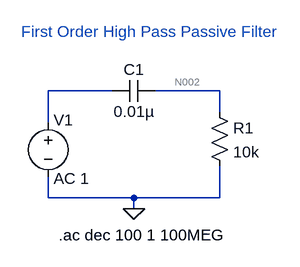
[diagram p0: schematic First Order High pass Passive Filter.asc]
First Order High pass Passive Filter.asc, the LTspice schematic file:
Version 4
SHEET 1 880 680
WIRE 176 96 80 96
WIRE 336 96 240 96
WIRE 336 128 336 96
WIRE 80 144 80 96
WIRE 80 256 80 224
WIRE 208 256 80 256
WIRE 336 256 336 208
WIRE 336 256 208 256
WIRE 208 272 208 256
FLAG 208 272 0
SYMBOL cap 176 112 R270
WINDOW 0 32 32 VTop 2
WINDOW 3 0 32 VBottom 2
SYMATTR InstName C1
SYMATTR Value 0.01µ
SYMBOL res 320 112 R0
SYMATTR InstName R1
SYMATTR Value 10k
SYMBOL voltage 80 128 R0
WINDOW 0 8 12 Left 2
WINDOW 123 8 99 Left 2
WINDOW 39 0 0 Left 0
SYMATTR InstName V1
SYMATTR Value ""
SYMATTR Value2 AC 1
TEXT 40 8 Left 2 ;First Order High Pass Passive Filter
TEXT 96 312 Left 2 !.ac dec 100 1 100MEG

The netlist it stands for:
* First Order High pass Passive Filter.asc
C1 N001 N002 0.01µ
R1 N002 0 10k
V1 N001 0 AC 1
* First Order High Pass Passive Filter
.ac dec 100 1 100MEG
.backanno
.end

* Results of the author's LTspice run, read from the files saved beside the schematic
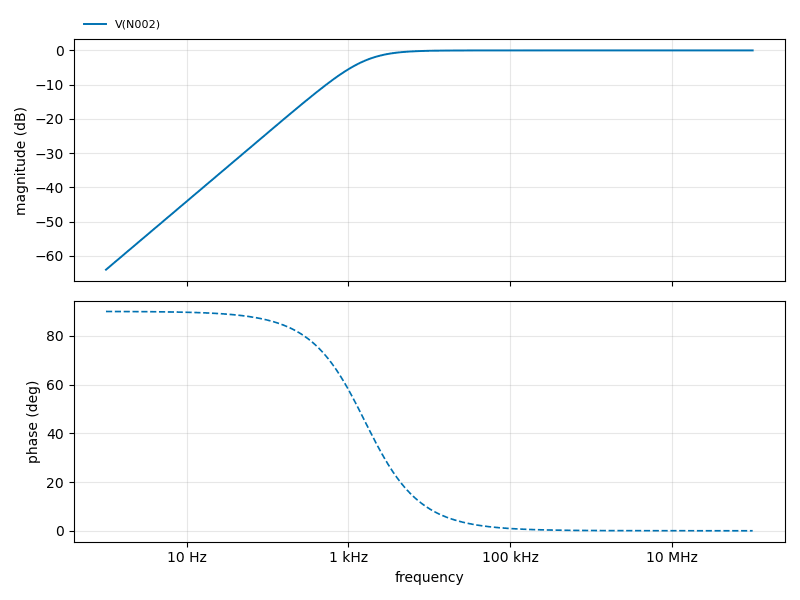
[diagram p1: AC Analysis of First Order High pass Passive Filter.asc, plotted from the saved traces]
* AC Analysis, 1 run:
*   V(N002): -64.04 dB at 1 Hz, -0.00 dB at 100 MHz, peak -0.00 dB at 100 MHz, 3 dB below the peak at 1.592 kHz